# EAGLE design 5V-to-12V-Converter-ManyDiodes (EAGLE 7.2.0)
+5V to +13V Converter A cheap circuit to make +13V from a +5V supply Roman Black - orig Sep 2002 - updated Aug 2006 http://www.romanblack.com/smps/conv.htm
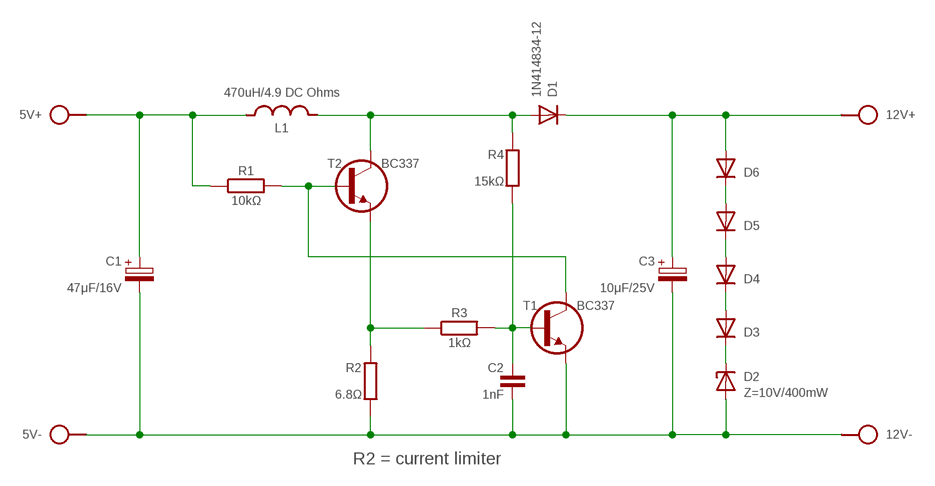
[diagram p0: schematic, sheet 1]

## Parts
5V  SPAD+--+  [SPAD-+]
12V  SPAD+-+-  [SPAD+-]
C1  47μF/16V  CPOLE2,5-4/V  [E2.5-4/V]
C2  1nF  C050-020X036  [C050-020X036]
C3  10μF/25V  CPOLE2,5-4/V  [E2.5-4/V]
D1  1N414834-12  [DO34-12]
D2  Z=10V/400mW  Z-DIODE-35Z10/V  [DO35Z10/V]
D3  1N4002-2.54A  [DO35-2_54A]
D4  1N4002-2.54  [DO35-2_54]
D5  1N4002-2.54A  [DO35-2_54A]
D6  1N4002-2.54  [DO35-2_54]
L1  470uH/4.9 DC Ohms  L-SHORTED16-X  [ED16-X]
R1  10kΩ  R-H0204/7-V  [0204/7-V]
R2  6.8Ω  R0204/10  [0204/10]
R3  1kΩ  R-H0204/10  [0204/10]
R4  15kΩ  R0204/7-V  [0204/7-V]
T1  BC337  BC337CBE  [TO92-CBE]
T2  BC337  BC337CBE  [TO92-CBE]

## Nets
GND: 5V.1 12V.1 C1.- C2.2 C3.- D2.A R2.1 T1.E
N$1: D2.C D3.C
N$2: 5V.2 C1.+ L1.1 R1.1
N$3: 12V.2 C3.+ D1.C D6.A
N$5: R2.2 R3.1 T2.E
N$6: C2.1 R3.2 R4.1 T1.B
N$7: R1.2 T1.C T2.B
N$8: D1.A L1.2 R4.2 T2.C
N$9: D3.A D4.C
N$10: D4.A D5.C
N$11: D5.A D6.C

## Notes on the sheet
- R2 = current limiter

## Library data of the parts
5V 12V = pad:SPAD+-
C1 C3 = c:CPOL: POLARIZED CAPACITOR, European symbol
C2 = c:C: CAPACITOR, European symbol
D1 = d:1N4148
D2 = d:Z-DIODE
D3-D6 = d:1N4002
L1 = l:L-SHORT
R1 R3 = r:R-H
R2 R4 = r:R: RESISTOR, European symbol
T1 T2 = t:BC337

## Net classes
0 default: width 0.61 mm

## Board
+5V to +13V Converter A cheap circuit to make +13V from a +5V supply Roman Black - orig Sep 2002 - updated Aug 2006 http://www.romanblack.com/smps/conv.htm
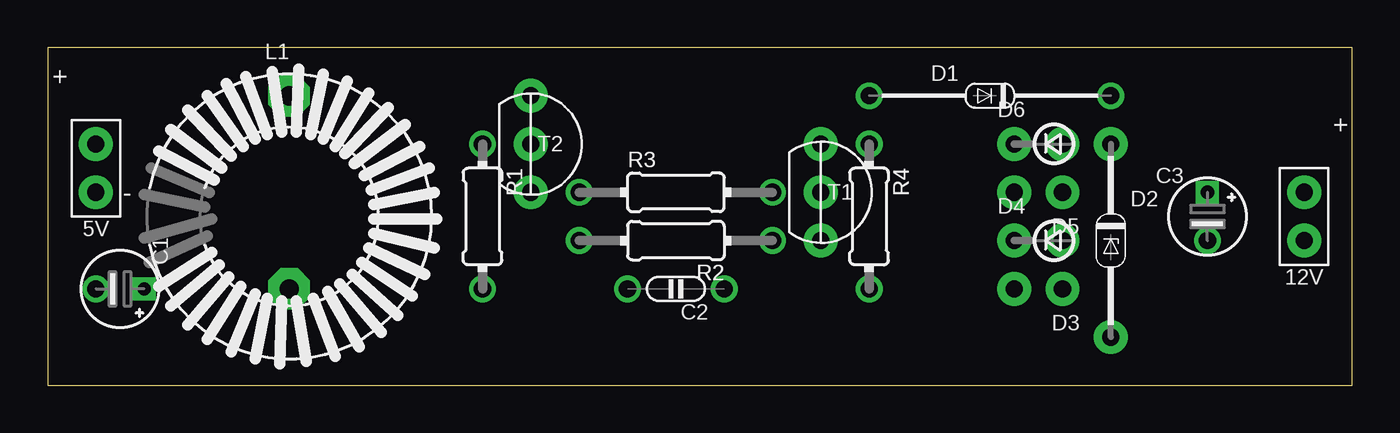
[diagram p1: board, top side]
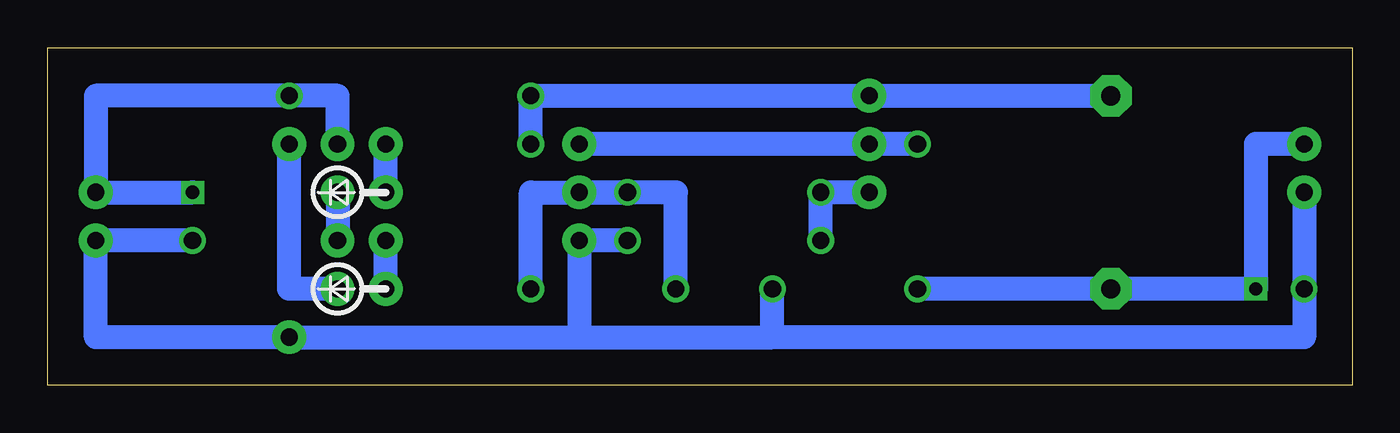
[diagram p2: board, bottom side, seen from below]

Size 68.58 x 17.78 mm. Coordinates in mm from the lower left corner, seen from the top.
Outline: 0,0 68.58,0 68.58,17.78 0,17.78 0,0
Copper layers (1*16): Top 0.035mm / dielectric 1.5mm / Bottom 0.035mm
Design rules "default": minimum track width 10mil, minimum drill 24mil, track to track 8mil, track to pad 8mil, pad to pad 8mil, via to via 8mil, smd to smd 8mil, copper to edge 40mil, drill to drill 8mil, minimum pad ring 10mil, minimum via ring 8mil, stop-mask expansion 4mil, vias tented up to drill 0mil, thermal gap 10mil

### Footprints (pad centres in the part's own frame; a part is rotated, then mirrored left to right if it is on the bottom)
SPAD-+ = drill 0.9 pad 1.778: 1 0,-1.27; 2 0,1.27
SPAD+- = drill 0.9 pad 1.778: 1 0,-1.27; 2 0,1.27
E2.5-4/V = drill 0.7 square: + 0,1.27 | drill 0.9: - 0,-1.27
C050-020X036 = drill 0.9: 1 -2.54,0; 2 2.54,0
DO34-12 = drill 0.9: A 6.35,0; C -6.35,0
DO35Z10/V = drill 0.9 pad 1.778: A 0,-5.08; C 0,5.08
DO35-2_54A = drill 0.9 pad 1.778: A 1.27,0; C -1.27,0
DO35-2_54 = drill 0.9 pad 1.778: A 1.27,0; C -1.27,0
ED16-X = drill 1.016 pad 2.184 octagon: 1 0,-3.81; 2 0,6.35
0204/7-V = drill 0.9: 1 0,3.81; 2 0,-3.81
0204/10 = drill 0.9: 1 -5.08,0; 2 5.08,0
TO92-CBE = drill 0.9 pad 1.778: B 0,0; C 0,2.54; E 0,-2.54

### Placement (x,y rotation side)
5V  2.54,11.43 0 top
12V  66.04,8.89 0 top
C1  3.81,5.08 270 top
C2  33.02,5.08 180 top
C3  60.96,8.89 0 top
D1  49.53,15.24 180 top
D2  55.88,7.62 0 top
D3  52.07,5.08 180 top
D4  52.07,7.62 0 top
D5  52.07,10.16 180 top
D6  52.07,12.7 0 top
L1  12.7,8.89 0 top
R1  22.86,8.89 180 top
R2  33.02,7.62 180 top
R3  33.02,10.16 0 top
R4  43.18,8.89 180 top
T1  40.64,10.16 0 top
T2  25.4,12.7 0 top

### Tracks (layer width: path | path; a pad name or v marks a point on that pad's centre or on a via)
GND
  Bottom 1.27: R2.1 T1.E 40.64,2.54 | 5V.1 2.54,2.54 30.48,2.54 | 40.64,2.54 30.48,2.54 | 30.48,2.54 C2.2 | C3.- 12V.1 66.04,2.54 D2.A 40.64,2.54
N$1
  Bottom 1.27: D3.C 55.88,5.08 D2.C
N$2
  Bottom 1.27: R1.1 L1.1 C1.+ 5.08,12.7 5V.2
N$3
  Bottom 1.27: C3.+ 12V.2 66.04,15.24 D1.C 53.34,15.24 D6.A
N$5
  Bottom 1.27: R2.2 R3.1 T2.E
N$6
  Bottom 1.27: T1.B R3.2 | C2.1 35.56,10.16 T1.B | R4.1 43.18,10.16 T1.B
N$7
  Bottom 1.27: R1.2 T2.B T1.C
N$8
  Bottom 1.27: R4.2 D1.A T2.C L1.2
N$9
  Bottom 1.27: D3.A D4.C
N$10
  Bottom 1.27: D5.C D4.A
N$11
  Bottom 1.27: D5.A D6.C